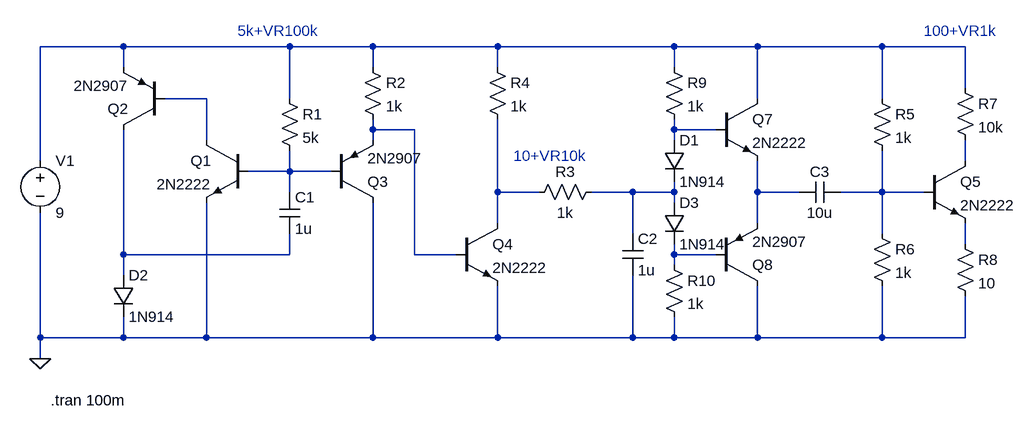
[diagram p0: schematic RelaxationOscillator2.asc]
RelaxationOscillator2.asc, the LTspice schematic file:
Version 4
SHEET 1 960 680
WIRE -560 32 -688 32
WIRE -304 32 -560 32
WIRE -176 32 -304 32
WIRE 16 32 -176 32
WIRE 288 32 16 32
WIRE 416 32 288 32
WIRE 608 32 416 32
WIRE 736 32 608 32
WIRE -560 64 -560 32
WIRE -176 64 -176 32
WIRE 16 64 16 32
WIRE 288 64 288 32
WIRE 736 96 736 32
WIRE -432 112 -496 112
WIRE -304 112 -304 32
WIRE 416 112 416 32
WIRE 608 112 608 32
WIRE -176 160 -176 144
WIRE -112 160 -176 160
WIRE 288 160 288 144
WIRE 352 160 288 160
WIRE -432 176 -432 112
WIRE -176 176 -176 160
WIRE 288 176 288 160
WIRE -688 208 -688 32
WIRE 736 208 736 176
WIRE -304 224 -304 192
WIRE -304 224 -368 224
WIRE -240 224 -304 224
WIRE -304 256 -304 224
WIRE 16 256 16 144
WIRE 80 256 16 256
WIRE 224 256 160 256
WIRE 288 256 288 240
WIRE 288 256 224 256
WIRE 416 256 416 208
WIRE 480 256 416 256
WIRE 608 256 608 192
WIRE 608 256 544 256
WIRE 672 256 608 256
WIRE 288 272 288 256
WIRE 16 304 16 256
WIRE 416 304 416 256
WIRE 224 320 224 256
WIRE 608 320 608 256
WIRE 736 336 736 304
WIRE -560 352 -560 160
WIRE -304 352 -304 320
WIRE -304 352 -560 352
WIRE -112 352 -112 160
WIRE -48 352 -112 352
WIRE 288 352 288 336
WIRE 352 352 288 352
WIRE 288 368 288 352
WIRE -560 384 -560 352
WIRE -688 480 -688 288
WIRE -560 480 -560 448
WIRE -560 480 -688 480
WIRE -432 480 -432 272
WIRE -432 480 -560 480
WIRE -176 480 -176 272
WIRE -176 480 -432 480
WIRE 16 480 16 400
WIRE 16 480 -176 480
WIRE 224 480 224 384
WIRE 224 480 16 480
WIRE 288 480 288 448
WIRE 288 480 224 480
WIRE 416 480 416 400
WIRE 416 480 288 480
WIRE 608 480 608 400
WIRE 608 480 416 480
WIRE 736 480 736 416
WIRE 736 480 608 480
WIRE -688 512 -688 480
FLAG -688 512 0
SYMBOL npn -368 176 M0
SYMATTR InstName Q1
SYMATTR Value 2N2222
SYMBOL cap -320 256 R0
SYMATTR InstName C1
SYMATTR Value 1u
SYMBOL res -320 96 R0
SYMATTR InstName R1
SYMATTR Value 5k
SYMBOL pnp -496 160 R180
SYMATTR InstName Q2
SYMATTR Value 2N2907
SYMBOL voltage -688 192 R0
WINDOW 123 0 0 Left 0
WINDOW 39 0 0 Left 0
SYMATTR InstName V1
SYMATTR Value 9
SYMBOL diode -576 384 R0
SYMATTR InstName D2
SYMATTR Value 1N914
SYMATTR Description Light Emitting Diode
SYMATTR Type led
SYMBOL pnp -240 272 M180
SYMATTR InstName Q3
SYMATTR Value 2N2907
SYMBOL res -192 48 R0
SYMATTR InstName R2
SYMATTR Value 1k
SYMBOL npn -48 304 R0
SYMATTR InstName Q4
SYMATTR Value 2N2222
SYMBOL res 0 48 R0
SYMATTR InstName R4
SYMATTR Value 1k
SYMBOL res 176 240 R90
WINDOW 0 0 56 VBottom 2
WINDOW 3 32 56 VTop 2
SYMATTR InstName R3
SYMATTR Value 1k
SYMBOL cap 208 320 R0
SYMATTR InstName C2
SYMATTR Value 1u
SYMBOL npn 352 112 R0
SYMATTR InstName Q7
SYMATTR Value 2N2222
SYMBOL pnp 352 400 M180
SYMATTR InstName Q8
SYMATTR Value 2N2907
SYMBOL cap 544 240 R90
WINDOW 0 0 32 VBottom 2
WINDOW 3 32 32 VTop 2
SYMATTR InstName C3
SYMATTR Value 10u
SYMBOL res 592 96 R0
SYMATTR InstName R5
SYMATTR Value 1k
SYMBOL res 592 304 R0
SYMATTR InstName R6
SYMATTR Value 1k
SYMBOL npn 672 208 R0
SYMATTR InstName Q5
SYMATTR Value 2N2222
SYMBOL res 720 80 R0
SYMATTR InstName R7
SYMATTR Value 10k
SYMBOL res 720 320 R0
SYMATTR InstName R8
SYMATTR Value 10
SYMBOL diode 272 176 R0
SYMATTR InstName D1
SYMATTR Value 1N914
SYMBOL diode 272 272 R0
SYMATTR InstName D3
SYMATTR Value 1N914
SYMBOL res 272 48 R0
SYMATTR InstName R9
SYMATTR Value 1k
SYMBOL res 272 352 R0
SYMATTR InstName R10
SYMATTR Value 1k
TEXT -672 576 Left 2 !.tran 100m
TEXT -384 8 Left 2 ;5k+VR100k
TEXT 40 200 Left 2 ;10+VR10k
TEXT 672 8 Left 2 ;100+VR1k

The netlist it stands for:
* RelaxationOscillator2.asc
Q1 N002 N006 0 0 2N2222
C1 N006 N012 1u
R1 N001 N006 5k
Q2 N012 N002 N001 0 2N2907
V1 N001 0 9
D2 N012 0 1N914
Q3 0 N006 N003 0 2N2907
R2 N001 N003 1k
Q4 N007 N003 0 0 2N2222
R4 N001 N007 1k
R3 N008 N007 1k
C2 N008 0 1u
Q7 N001 N004 N009 0 2N2222
Q8 0 N013 N009 0 2N2907
C3 N010 N009 10u
R5 N001 N010 1k
R6 N010 0 1k
Q5 N005 N010 N011 0 2N2222
R7 N001 N005 10k
R8 N011 0 10
D1 N004 N008 1N914
D3 N008 N013 1N914
R9 N001 N004 1k
R10 N013 0 1k
.model D D
.lib standard.dio
.model NPN NPN
.model PNP PNP
.lib standard.bjt
.tran 100m
* 5k+VR100k
* 10+VR10k
* 100+VR1k
.backanno
.end